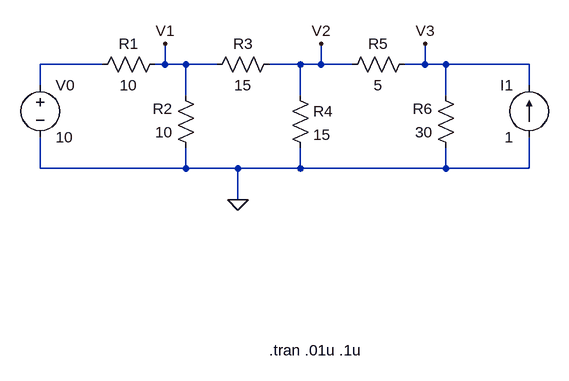
[diagram p0: schematic easy_circuit.asc]
easy_circuit.asc, the LTspice schematic file:
Version 4
SHEET 1 880 680
WIRE 160 192 64 192
WIRE 256 192 256 160
WIRE 256 192 240 192
WIRE 288 192 256 192
WIRE 336 192 288 192
WIRE 464 192 416 192
WIRE 496 192 496 160
WIRE 496 192 464 192
WIRE 544 192 496 192
WIRE 656 192 656 160
WIRE 656 192 624 192
WIRE 688 192 656 192
WIRE 816 192 688 192
WIRE 64 224 64 192
WIRE 816 224 816 192
WIRE 288 240 288 192
WIRE 464 240 464 192
WIRE 688 240 688 192
WIRE 64 352 64 304
WIRE 288 352 288 320
WIRE 288 352 64 352
WIRE 368 352 288 352
WIRE 464 352 464 320
WIRE 464 352 368 352
WIRE 688 352 688 320
WIRE 688 352 464 352
WIRE 816 352 816 304
WIRE 816 352 688 352
WIRE 368 400 368 352
FLAG 368 400 0
FLAG 256 160 V1
FLAG 496 160 V2
FLAG 656 160 V3
SYMBOL res 256 176 R90
WINDOW 0 0 56 VBottom 2
WINDOW 3 32 56 VTop 2
SYMATTR InstName R1
SYMATTR Value 10
SYMBOL res 304 336 R180
WINDOW 0 36 76 Left 2
WINDOW 3 36 40 Left 2
SYMATTR InstName R2
SYMATTR Value 10
SYMBOL res 320 208 R270
WINDOW 0 32 56 VTop 2
WINDOW 3 0 56 VBottom 2
SYMATTR InstName R3
SYMATTR Value 15
SYMBOL res 448 224 R0
SYMATTR InstName R4
SYMATTR Value 15
SYMBOL res 640 176 R90
WINDOW 0 0 56 VBottom 2
WINDOW 3 32 56 VTop 2
SYMATTR InstName R5
SYMATTR Value 5
SYMBOL res 704 336 R180
WINDOW 0 36 76 Left 2
WINDOW 3 36 40 Left 2
SYMATTR InstName R6
SYMATTR Value 30
SYMBOL voltage 64 208 R0
SYMATTR InstName V0
SYMATTR Value 10
SYMBOL current 816 304 R180
WINDOW 0 24 80 Left 2
WINDOW 3 24 0 Left 2
SYMATTR InstName I1
SYMATTR Value 1
TEXT 416 632 Left 2 !.tran .01u .1u

The netlist it stands for:
* easy_circuit.asc
R1 V1 N001 10
R2 0 V1 10
R3 V1 V2 15
R4 V2 0 15
R5 V3 V2 5
R6 0 V3 30
V0 N001 0 10
I1 0 V3 1
.tran .01u .1u
.backanno
.end